# Altium schematic sheet FlexEMG_v0r0_SF2_unused.SchDoc
size B
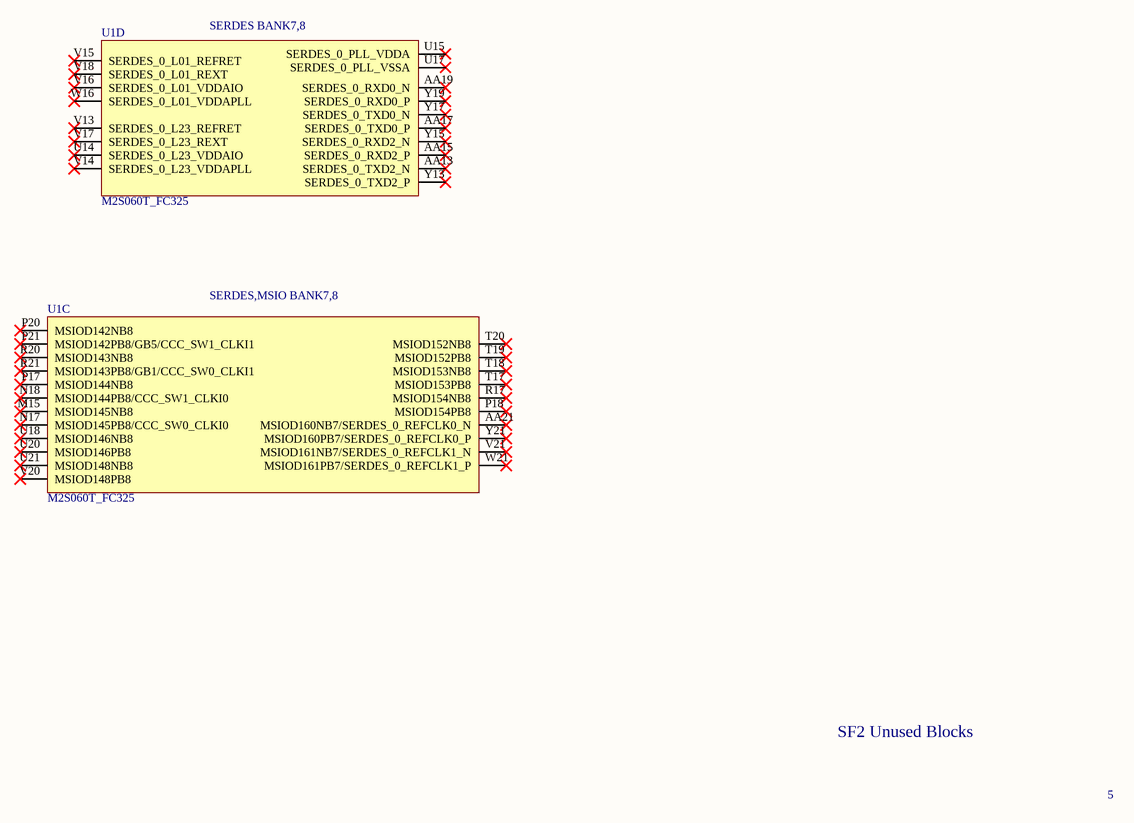
[diagram p0: FlexEMG_v0r0_SF2_unused.SchDoc]

## Parts
U1  M2S060T_FC325  [MCSM-CS-325]  (parts C,D of 9)

## Nets

Not connected (* = marked no-connect by the designer): U1 AA13(SERDES_0_TXD2_N)* AA15(SERDES_0_RXD2_P)* AA17(SERDES_0_TXD0_P)* AA19(SERDES_0_RXD0_N)* AA21(MSIOD160NB7/SERDES_0_REFCLK0_N)* M15(MSIOD145NB8)* N17(MSIOD145PB8/CCC_SW0_CLKI0)* N18(MSIOD144PB8/CCC_SW1_CLKI0)* P17(MSIOD144NB8)* P18(MSIOD154PB8)* P20(MSIOD142NB8)* P21(MSIOD142PB8/GB5/CCC_SW1_CLKI1)* R17(MSIOD154NB8)* R20(MSIOD143NB8)* R21(MSIOD143PB8/GB1/CCC_SW0_CLKI1)* T17(MSIOD153PB8)* T18(MSIOD153NB8)* T19(MSIOD152PB8)* T20(MSIOD152NB8)* U14(SERDES_0_L23_VDDAIO)* U15(SERDES_0_PLL_VDDA)* U17(SERDES_0_PLL_VSSA)* U18(MSIOD146NB8)* U20(MSIOD146PB8)* U21(MSIOD148NB8)* V13(SERDES_0_L23_REFRET)* V14(SERDES_0_L23_VDDAPLL)* V15(SERDES_0_L01_REFRET)* V16(SERDES_0_L01_VDDAIO)* V17(SERDES_0_L23_REXT)* V18(SERDES_0_L01_REXT)* V20(MSIOD148PB8)* V21(MSIOD161NB7/SERDES_0_REFCLK1_N)* W16(SERDES_0_L01_VDDAPLL)* W21(MSIOD161PB7/SERDES_0_REFCLK1_P)* Y13(SERDES_0_TXD2_P)* Y15(SERDES_0_RXD2_N)* Y17(SERDES_0_TXD0_N)* Y19(SERDES_0_RXD0_P)* Y21(MSIOD160PB7/SERDES_0_REFCLK0_P)*

## Notes on the sheet
- (near U1) SERDES BANK7,8
- (near U1) SERDES,MSIO BANK7,8
- SF2 Unused Blocks
- 5

## Library data of the parts
U1 = M2S060T_FC325: SmartFusion2; Manufacturer PN: M2S060T-CS325; Manufacturer: Microsemi; Supplier: Future; Supplier PN: M2S060T-FCSG325I